# Altium schematic sheet Medidas.SchDoc
size 508 x 508 mm
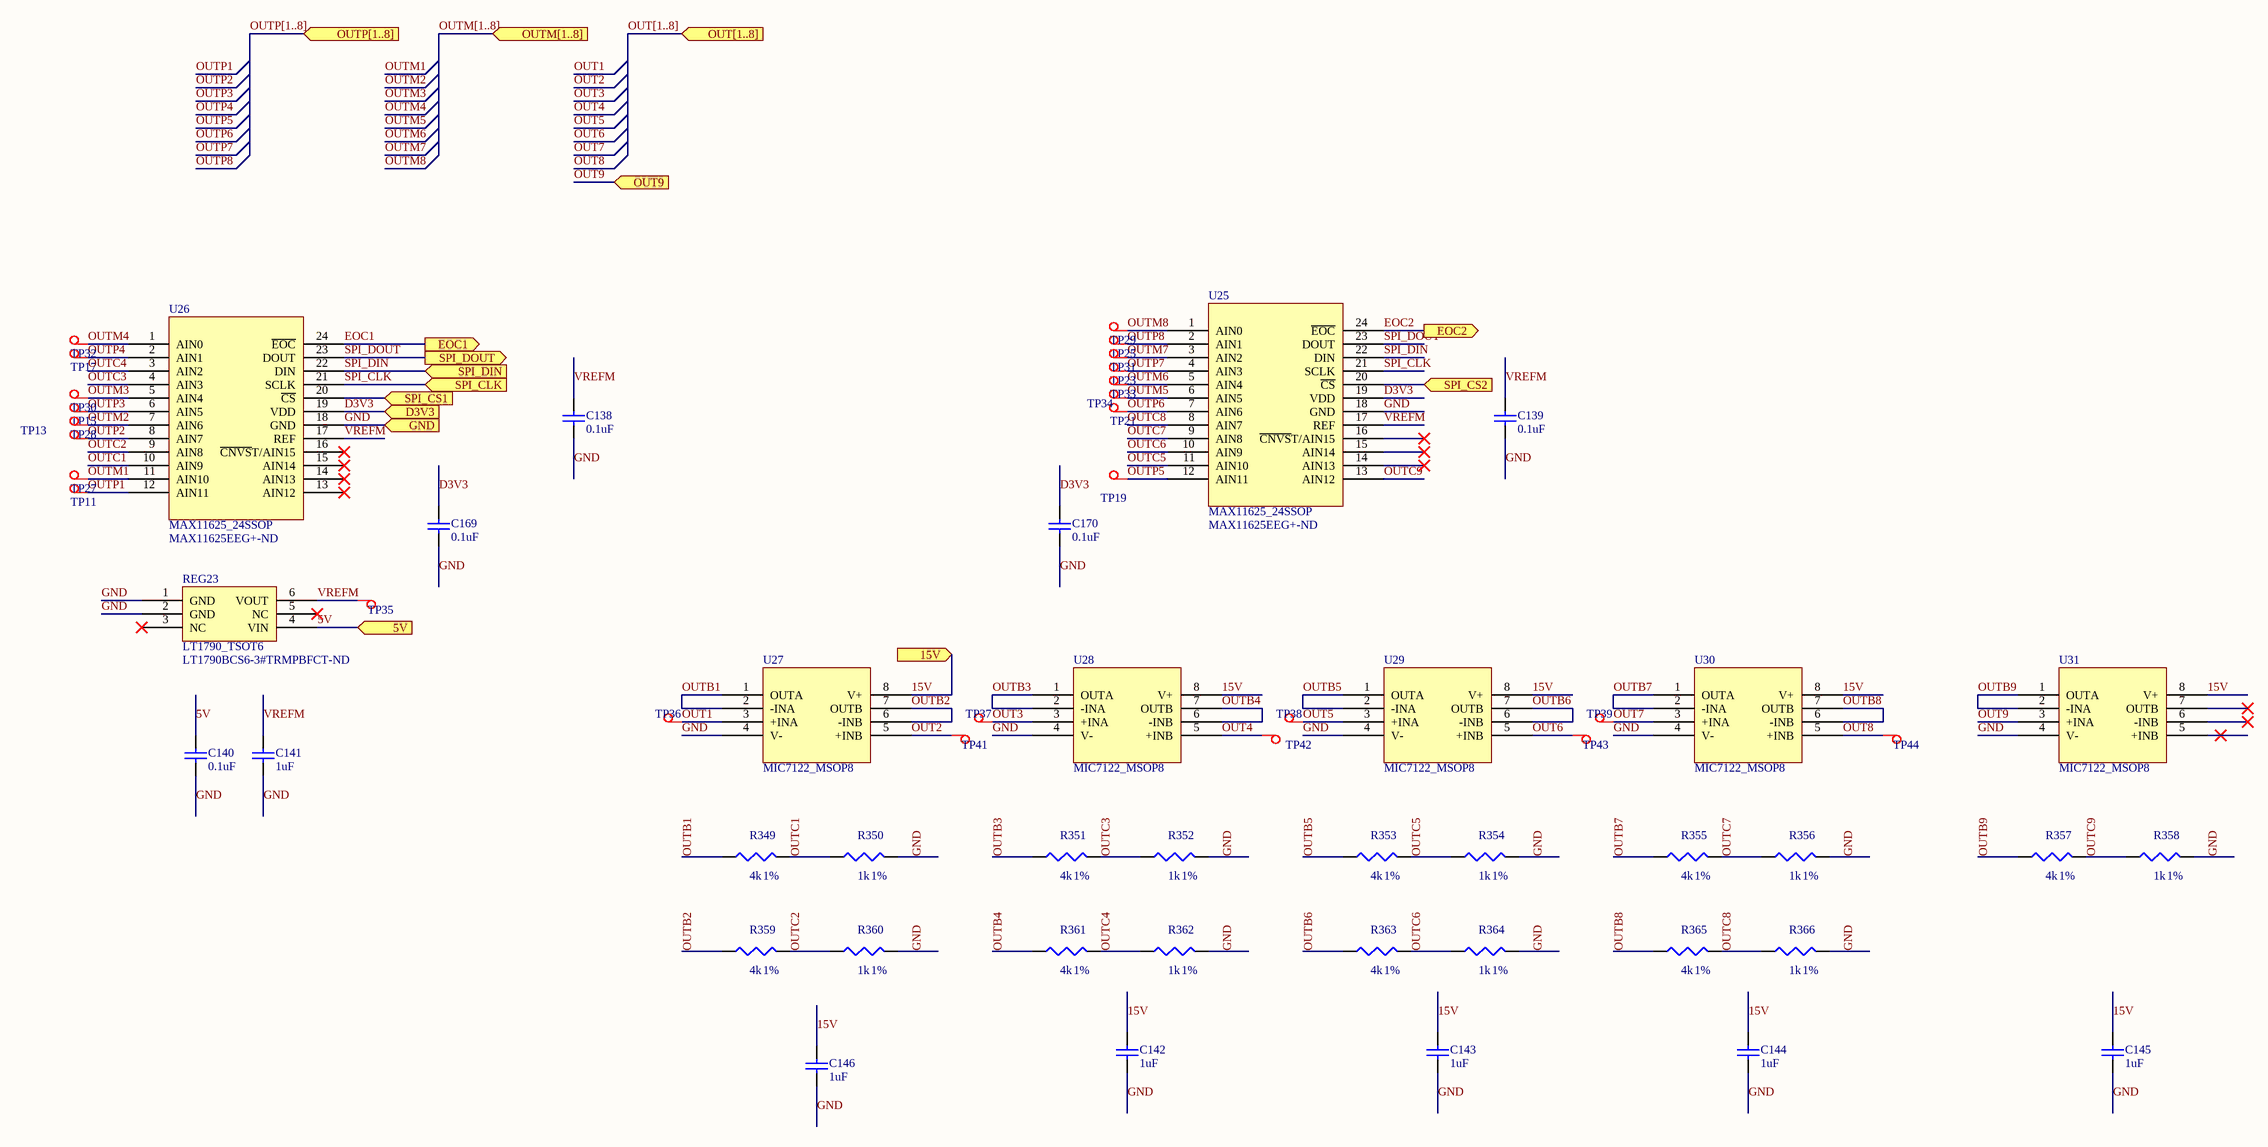
[diagram p0: Medidas.SchDoc]

## Parts
C138  value 0.1uF  [J1-0603]  (hidden comment: Cap)
C139  value 0.1uF  [J1-0603]  (hidden comment: Cap)
C140  value 0.1uF  [J1-0603]  (hidden comment: Cap)
C141  value 1uF  [J1-0603]  (hidden comment: Cap)
C142  value 1uF  [J1-0603]  (hidden comment: Cap)
C143  value 1uF  [J1-0603]  (hidden comment: Cap)
C144  value 1uF  [J1-0603]  (hidden comment: Cap)
C145  value 1uF  [J1-0603]  (hidden comment: Cap)
C146  value 1uF  [J1-0603]  (hidden comment: Cap)
C169  value 0.1uF  [J1-0603]  (hidden comment: Cap)
C170  value 0.1uF  [J1-0603]  (hidden comment: Cap)
R349  value 4k  Tolerance: 1%  [J1-0603]  (hidden comment: Res3)
R350  value 1k  Tolerance: 1%  [J1-0603]  (hidden comment: Res3)
R351  value 4k  Tolerance: 1%  [J1-0603]  (hidden comment: Res3)
R352  value 1k  Tolerance: 1%  [J1-0603]  (hidden comment: Res3)
R353  value 4k  Tolerance: 1%  [J1-0603]  (hidden comment: Res3)
R354  value 1k  Tolerance: 1%  [J1-0603]  (hidden comment: Res3)
R355  value 4k  Tolerance: 1%  [J1-0603]  (hidden comment: Res3)
R356  value 1k  Tolerance: 1%  [J1-0603]  (hidden comment: Res3)
R357  value 4k  Tolerance: 1%  [J1-0603]  (hidden comment: Res3)
R358  value 1k  Tolerance: 1%  [J1-0603]  (hidden comment: Res3)
R359  value 4k  Tolerance: 1%  [J1-0603]  (hidden comment: Res3)
R360  value 1k  Tolerance: 1%  [J1-0603]  (hidden comment: Res3)
R361  value 4k  Tolerance: 1%  [J1-0603]  (hidden comment: Res3)
R362  value 1k  Tolerance: 1%  [J1-0603]  (hidden comment: Res3)
R363  value 4k  Tolerance: 1%  [J1-0603]  (hidden comment: Res3)
R364  value 1k  Tolerance: 1%  [J1-0603]  (hidden comment: Res3)
R365  value 4k  Tolerance: 1%  [J1-0603]  (hidden comment: Res3)
R366  value 1k  Tolerance: 1%  [J1-0603]  (hidden comment: Res3)
REG23  LT1790_TSOT6  Supplier Part Number 1: LT1790BCS6-3#TRMPBFCT-ND  [LT1790_TSOT6]
TP11  Test Point  [TestPoint]  (value not drawn)
TP13  Test Point  [TestPoint]  (value not drawn)
TP15  Test Point  [TestPoint]  (value not drawn)
TP17  Test Point  [TestPoint]  (value not drawn)
TP19  Test Point  [TestPoint]  (value not drawn)
TP21  Test Point  [TestPoint]  (value not drawn)
TP23  Test Point  [TestPoint]  (value not drawn)
TP25  Test Point  [TestPoint]  (value not drawn)
TP27  Test Point  [TestPoint]  (value not drawn)
TP28  Test Point  [TestPoint]  (value not drawn)
TP29  Test Point  [TestPoint]  (value not drawn)
TP30  Test Point  [TestPoint]  (value not drawn)
TP31  Test Point  [TestPoint]  (value not drawn)
TP32  Test Point  [TestPoint]  (value not drawn)
TP33  Test Point  [TestPoint]  (value not drawn)
TP34  Test Point  [TestPoint]  (value not drawn)
TP35  Test Point  [TestPoint]  (value not drawn)
TP36  Test Point  [TestPoint]  (value not drawn)
TP37  Test Point  [TestPoint]  (value not drawn)
TP38  Test Point  [TestPoint]  (value not drawn)
TP39  Test Point  [TestPoint]  (value not drawn)
TP41  Test Point  [TestPoint]  (value not drawn)
TP42  Test Point  [TestPoint]  (value not drawn)
TP43  Test Point  [TestPoint]  (value not drawn)
TP44  Test Point  [TestPoint]  (value not drawn)
U25  MAX11625_24SSOP  Supplier Part Number 1: MAX11625EEG+-ND  [MAX11625_24SSOP]
U26  MAX11625_24SSOP  Supplier Part Number 1: MAX11625EEG+-ND  [MAX11625_24SSOP]
U27  MIC7122_MSOP8  [MIC7122_MSOP8]
U28  MIC7122_MSOP8  [MIC7122_MSOP8]
U29  MIC7122_MSOP8  [MIC7122_MSOP8]
U30  MIC7122_MSOP8  [MIC7122_MSOP8]
U31  MIC7122_MSOP8  [MIC7122_MSOP8]

## Ports
5V (in), 15V (in), D3V3 (in), EOC1 (out), EOC2 (out), GND (in), OUT9 (in), OUT[1..8] (in), OUTM[1..8] (in), OUTP[1..8] (in), SPI_CLK (in), SPI_CS1 (in), SPI_CS2 (in), SPI_DIN (in), SPI_DOUT (out)

## Nets
5V: C140.1 REG23.4(VIN) ; port 5V
15V: C142.1 C143.1 C144.1 C145.1 C146.1 U27.8(V+) U28.8(V+) U29.8(V+) U30.8(V+) U31.8(V+) ; port 15V
D3V3: C169.1 C170.1 U25.19(VDD) U26.19(VDD) ; port D3V3
EOC1: U26.24(~{EOC}) ; port EOC1
EOC2: U25.24(~{EOC}) ; port EOC2
GND: C138.2 C139.2 C140.2 C141.2 C142.2 C143.2 C144.2 C145.2 C146.2 C169.2 C170.2 R350.2 R352.2 R354.2 R356.2 R358.2 R360.2 R362.2 R364.2 R366.2 REG23.1(GND) REG23.2(GND) U25.18(GND) U26.18(GND) U27.4(V-) U28.4(V-) U29.4(V-) U30.4(V-) U31.4(V-) ; port GND
OUT1: TP36.1(TP) U27.3(+INA)
OUT2: TP41.1(TP) U27.5(+INB)
OUT3: TP37.1(TP) U28.3(+INA)
OUT4: TP42.1(TP) U28.5(+INB)
OUT5: TP38.1(TP) U29.3(+INA)
OUT6: TP43.1(TP) U29.5(+INB)
OUT7: TP39.1(TP) U30.3(+INA)
OUT8: TP44.1(TP) U30.5(+INB)
OUT9: U31.3(+INA) ; port OUT9
OUTB1: R349.1 U27.1(OUTA) U27.2(-INA)
OUTB2: R359.1 U27.6(-INB) U27.7(OUTB)
OUTB3: R351.1 U28.1(OUTA) U28.2(-INA)
OUTB4: R361.1 U28.6(-INB) U28.7(OUTB)
OUTB5: R353.1 U29.1(OUTA) U29.2(-INA)
OUTB6: R363.1 U29.6(-INB) U29.7(OUTB)
OUTB7: R355.1 U30.1(OUTA) U30.2(-INA)
OUTB8: R365.1 U30.6(-INB) U30.7(OUTB)
OUTB9: R357.1 U31.1(OUTA) U31.2(-INA)
OUTC1: R349.2 R350.1 U26.10(AIN9)
OUTC2: R359.2 R360.1 U26.9(AIN8)
OUTC3: R351.2 R352.1 U26.4(AIN3)
OUTC4: R361.2 R362.1 U26.3(AIN2)
OUTC5: R353.2 R354.1 U25.11(AIN10)
OUTC6: R363.2 R364.1 U25.10(AIN9)
OUTC7: R355.2 R356.1 U25.9(AIN8)
OUTC8: R365.2 R366.1 U25.8(AIN7)
OUTC9: R357.2 R358.1 U25.13(AIN12)
OUTM1: TP27.1(TP) U26.11(AIN10)
OUTM2: TP28.1(TP) U26.7(AIN6)
OUTM3: TP30.1(TP) U26.5(AIN4)
OUTM4: TP32.1(TP) U26.1(AIN0)
OUTM5: TP34.1(TP) U25.6(AIN5)
OUTM6: TP33.1(TP) U25.5(AIN4)
OUTM7: TP31.1(TP) U25.3(AIN2)
OUTM8: TP29.1(TP) U25.1(AIN0)
OUTP1: TP11.1(TP) U26.12(AIN11)
OUTP2: TP13.1(TP) U26.8(AIN7)
OUTP3: TP15.1(TP) U26.6(AIN5)
OUTP4: TP17.1(TP) U26.2(AIN1)
OUTP5: TP19.1(TP) U25.12(AIN11)
OUTP6: TP21.1(TP) U25.7(AIN6)
OUTP7: TP23.1(TP) U25.4(AIN3)
OUTP8: TP25.1(TP) U25.2(AIN1)
SPI_CLK: U25.21(SCLK) U26.21(SCLK) ; port SPI_CLK
SPI_CS1: U26.20(~{CS}) ; port SPI_CS1
SPI_CS2: U25.20(~{CS}) ; port SPI_CS2
SPI_DIN: U25.22(DIN) U26.22(DIN) ; port SPI_DIN
SPI_DOUT: U25.23(DOUT) U26.23(DOUT) ; port SPI_DOUT
VREFM: C138.1 C139.1 C141.1 REG23.6(VOUT) TP35.1(TP) U25.17(REF) U26.17(REF)

Not connected (* = marked no-connect by the designer): REG23 3(NC)* 5(NC)*; U25 14(AIN13)* 15(AIN14)* 16(~{CNVS}T/AIN15)*; U26 13(AIN12)* 14(AIN13)* 15(AIN14)* 16(~{CNVS}T/AIN15)*; U31 5(+INB)* 6(-INB)* 7(OUTB)*

## Buses and harness runs
bus OUT[1..8] = port OUT[1..8]
bus OUTM[1..8] = port OUTM[1..8]
bus OUTP[1..8] = port OUTP[1..8]

## Library data of the parts
C138-C146 C169 C170 = Cap: Capacitor; Published: 8-Jun-2000; LatestRevisionDate: 17-Jul-2002; LatestRevisionNote: Re-released for DXP Platform.; PackageReference: RAD-0.3; Publisher: Altium Limited; PackageDescription: Radial Cap, Thru-Hole; 2 Leads; 0.3 in Pin Spacing; Supplier 1: Digi-Key
  C138-C140 C169 C170: Supplier Part Number 1: 490-1532-1-ND
  C141-C146: Supplier Part Number 1: 1276-1184-1-ND
R349-R366 = Res3: Resistor; Published: 8-Jun-2000; LatestRevisionDate: 29-May-2009; LatestRevisionNote: IPC-7351 Footprint Added.; PackageReference: J1-0603; Publisher: Altium Limited; PackageDescription: Chip Resistor; Supplier 1: Digi-Key
  R349 R351 R353 R355 R357 R359 R361 R363 R365: Supplier Part Number 1: P4.02KDBCT-ND
  R350 R352 R354 R356 R358 R360 R362 R364 R366: Supplier Part Number 1: P1.0KDBCT-ND
REG23 = LT1790_TSOT6: Supplier 1: Digi-Key
TP11 TP13 TP15 TP17 TP19 TP21 TP23 TP25 TP27-TP39 TP41-TP44 = Test Point: Supplier 1: Digi-Key; Supplier Part Number 1: 36-5019CT-ND
U25 U26 = MAX11625_24SSOP: Supplier 1: Digi-Key
U27-U31 = MIC7122_MSOP8: Supplier 1: Digi-Key; Supplier Part Number 1: 576-1317-1-ND